# EAGLE design Blueshift V3 (EAGLE 9.5.1)
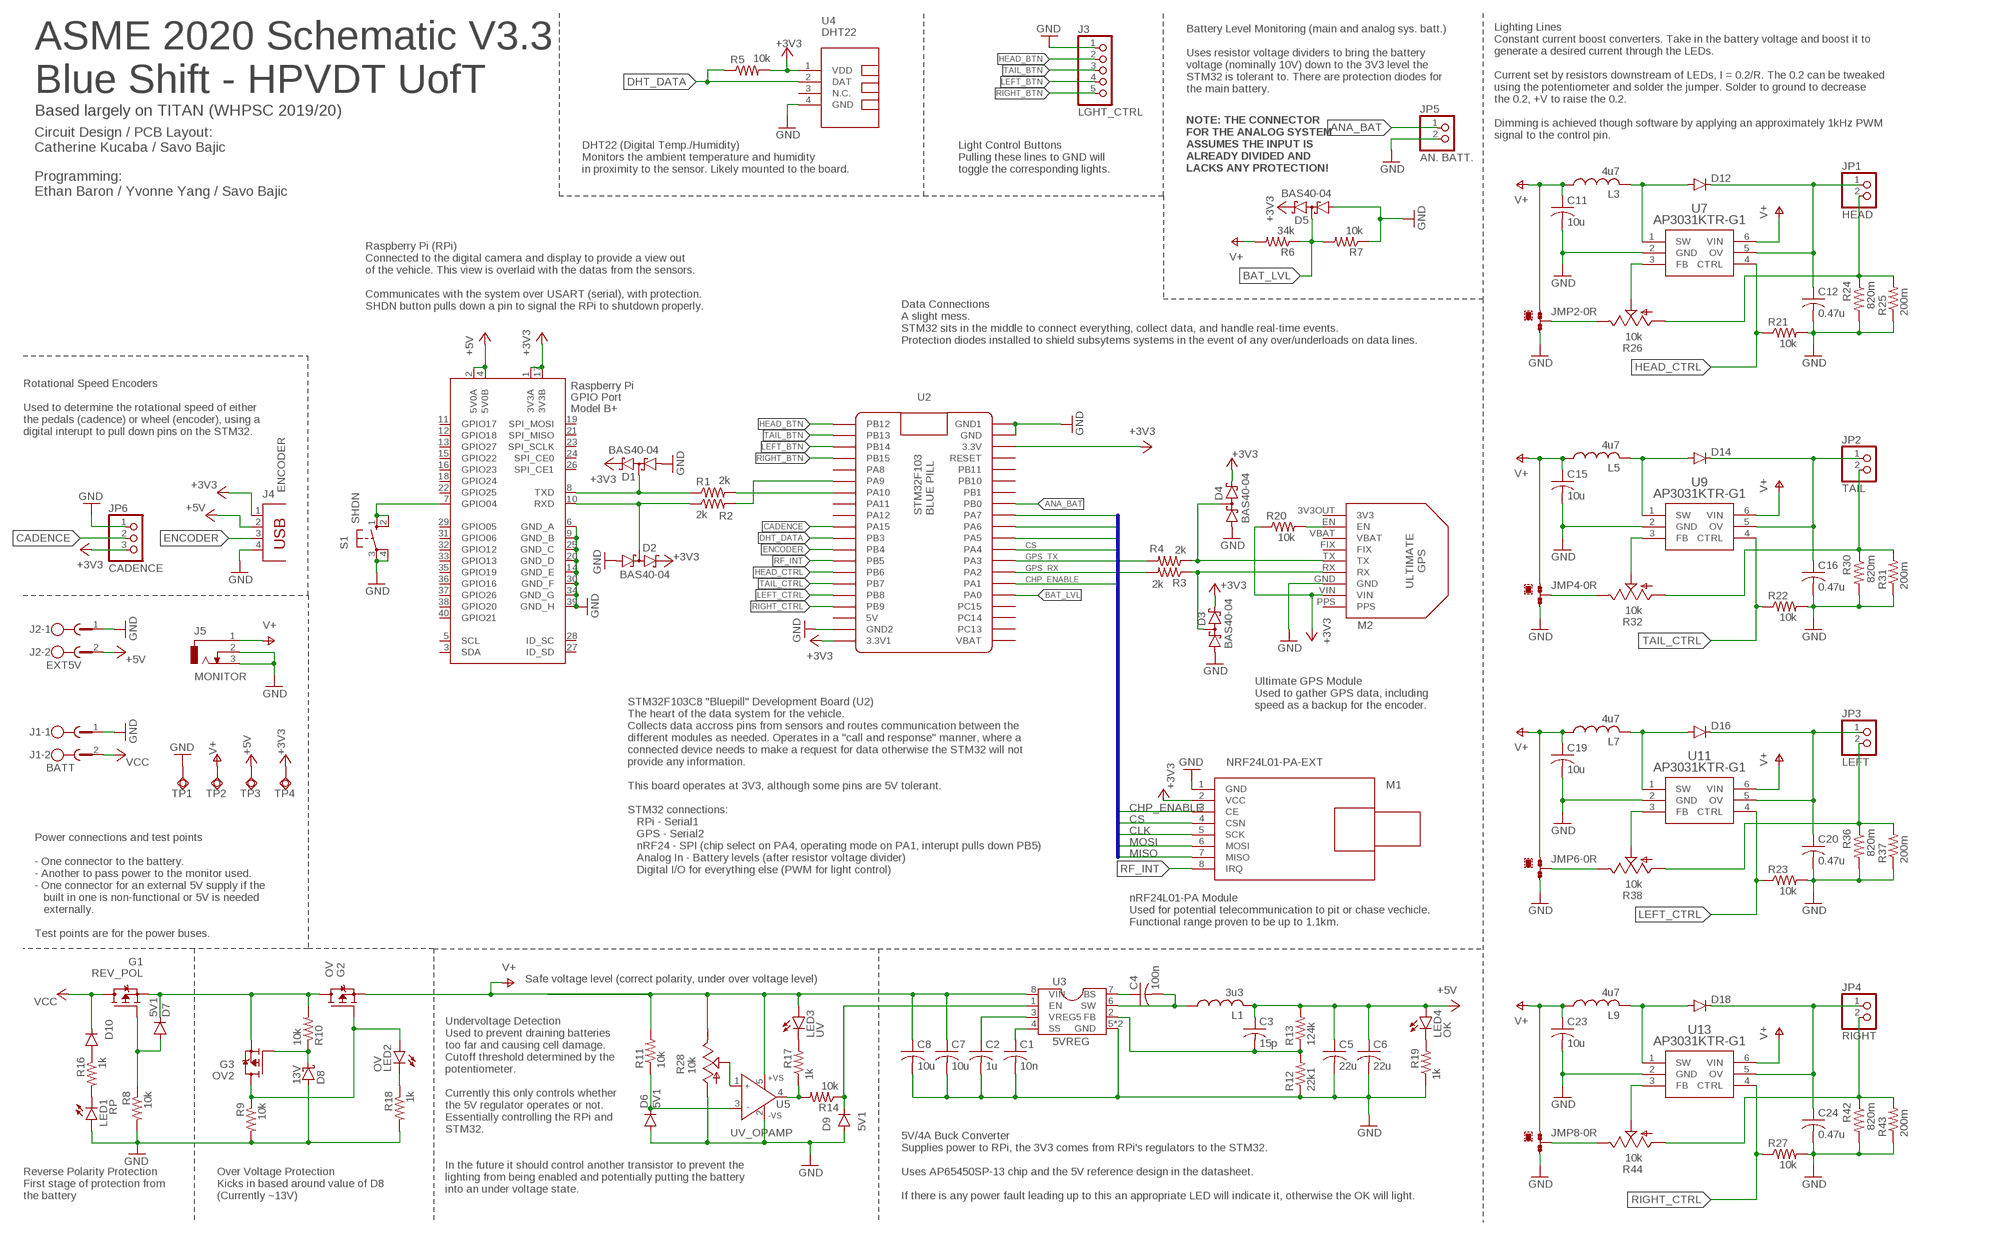
[diagram p0: schematic, sheet 1]

## Parts
C1  10n  C-USC0402  [C0402]
C2  1u  C-USC0402  [C0402]
C3  15p  C-USC0402  [C0402]
C4  100n  C-USC0402  [C0402]
C5  22u  C-USC0805  [C0805]
C6  22u  C-USC0805  [C0805]
C7  10u  C-USC0805  [C0805]
C8  10u  C-USC0805  [C0805]
C11  10u  C-USC1206K  [C1206K]
C12  0.47u  C-USC1206K  [C1206K]
C15  10u  C-USC1206K  [C1206K]
C16  0.47u  C-USC1206K  [C1206K]
C19  10u  C-USC1206K  [C1206K]
C20  0.47u  C-USC1206K  [C1206K]
C23  10u  C-USC1206K  [C1206K]
C24  0.47u  C-USC1206K  [C1206K]
D1  BAS40-04  [SOT23]
D2  BAS40-04  [SOT23]
D3  BAS40-04  [SOT23]
D4  BAS40-04  [SOT23]
D5  BAS40-04  [SOT23]
D6  5V1  DIODE-SOD323-R  [SOD323-R]
D7  5V1  DIODE-SOD323-R  [SOD323-R]
D8  13V  BAS70  [SOT23]
D9  5V1  DIODE-SOD323-R  [SOD323-R]
D10  DIODE-SOD80C  [SOD80C]
D12  DIODE-DO-214AC  [DO-214AC]
D14  DIODE-DO-214AC  [DO-214AC]
D16  DIODE-DO-214AC  [DO-214AC]
D18  DIODE-DO-214AC  [DO-214AC]
G1  REV_POL  SI3493DDV-T1-GE3  [TSOP-6]
G2  OV  SI3493DDV-T1-GE3  [TSOP-6]
G3  OV2  SI3493DDV-T1-GE3  [TSOP-6]
J1  BATT  MST2V  [MSTBV2]
J2  EXT5V  MST2V  [MSTBV2]
J3  LGHT_CTRL  PINHD-1X5  [1X05]
J4  ENCODER  PN87520  [PN87520]
J5  MONITOR  DCJ0303  [DCJ0303]
JMP2  0R-JUMPA  [A0R-JMP]
JMP4  0R-JUMPA  [A0R-JMP]
JMP6  0R-JUMPA  [A0R-JMP]
JMP8  0R-JUMPA  [A0R-JMP]
JP1  HEAD  PINHD-1X2  [1X02]
JP2  TAIL  PINHD-1X2  [1X02]
JP3  LEFT  PINHD-1X2  [1X02]
JP4  RIGHT  PINHD-1X2  [1X02]
JP5  AN. BATT.  PINHD-1X2  [1X02]
JP6  CADENCE  PINHD-1X3  [1X03]
L1  3u3  SDES064T-3R3MS  [SDES064T]
L3  4u7  NR6028NR6028  [INDDFN600X600X280-2N]
L5  4u7  NR6028NR6028  [INDDFN600X600X280-2N]
L7  4u7  NR6028NR6028  [INDDFN600X600X280-2N]
L9  4u7  NR6028NR6028  [INDDFN600X600X280-2N]
LED1  RP  LEDSML0805  [SML0805]
LED2  OV  LEDSML0805  [SML0805]
LED3  UV  LEDSML0805  [SML0805]
LED4  OK  LEDSML0805  [SML0805]
M1  NRF24L01-PA-EXT  WIRELESS-NRF24L01-PA-EXT  [WIRELESS-NRF24L01-PA-EXT]
M2  ULTIMATE-GPS  [ULTIMATE_GPS]
R1  2k  R-US_R0402  [R0402]
R2  2k  R-US_R0402  [R0402]
R3  2k  R-US_R0402  [R0402]
R4  2k  R-US_R0402  [R0402]
R5  10k  R-US_R0402  [R0402]
R6  34k  R-US_R0402  [R0402]
R7  10k  R-US_R0402  [R0402]
R8  10k  R-US_R0402  [R0402]
R9  10k  R-US_R0402  [R0402]
R10  10k  R-US_R0402  [R0402]
R11  10k  R-US_R0402  [R0402]
R12  22k1  R-US_R0402  [R0402]
R13  124k  R-US_R0402  [R0402]
R14  10k  R-US_R0402  [R0402]
R16  1k  R-US_R0402  [R0402]
R17  1k  R-US_R0402  [R0402]
R18  1k  R-US_R0402  [R0402]
R19  1k  R-US_R0402  [R0402]
R20  10k  R-US_R0402  [R0402]
R21  10k  R-US_R0402  [R0402]
R22  10k  R-US_R0402  [R0402]
R23  10k  R-US_R0402  [R0402]
R24  820m  R-US_R0603  [R0603]
R25  200m  R-US_R0805  [R0805]
R26  10k  TRIM_US-RJ9W  [RJ9W]
R27  10k  R-US_R0402  [R0402]
R28  10k  TRIM_US-RJ9W  [RJ9W]
R30  820m  R-US_R0603  [R0603]
R31  200m  R-US_R0805  [R0805]
R32  10k  TRIM_US-RJ9W  [RJ9W]
R36  820m  R-US_R0603  [R0603]
R37  200m  R-US_R0805  [R0805]
R38  10k  TRIM_US-RJ9W  [RJ9W]
R42  820m  R-US_R0603  [R0603]
R43  200m  R-US_R0805  [R0805]
R44  10k  TRIM_US-RJ9W  [RJ9W]
S1  SHDN  10-XX  [B3F-10XX]
TP1  TPSQTP20SQ  [TP20SQ]
TP2  TPSQTP20R  [TP20R]
TP3  TPSQTP20R  [TP20R]
TP4  TPSQTP20R  [TP20R]
U1  RASPI_HAT  [RASPI_BOARD_B+HAT_CF]
U2  BLUEPILL  BLUE_PILL  [BLUE_PILL]
U3  5VREG  AP65450SP-13  [SO-8EP]
U4  DHT22  TEMP-HUM-SENSOR-DHT22  [TEMP-HUM-SENSOR-DHT22]
U5  UV_OPAMP  TA75S558F,LF  [SOT-753]
U7  AP3031KTR-G1  [SOT23-6]
U9  AP3031KTR-G1  [SOT23-6]
U11  AP3031KTR-G1  [SOT23-6]
U13  AP3031KTR-G1  [SOT23-6]

## Nets
5V_FB: C3.2 R12.2 R13.1 U3.2(FB)
+3V3: D1.2(C2) D2.2(C2) D3.2(C2) D4.2(C2) D5.2(C2) J4.1 JP6.3 M1.2(VCC) M2.VIN R5.2 R20.1 TP4.TP U1.1(3V3A) U1.17(3V3B) U2.P$20(3.3V1) U2.P$23(3.3V) U4.1(VDD)
+5V: C3.1 C5.1 C6.1 J2.2 J4.2 L1.2 LED4.A R13.2 TP3.TP U1.2(5V0A) U1.4(5V0B)
ANA_BAT: JP5.1 U2.P$28(PB0)
BAT_LVL: D5.3(C1A2) R6.1 R7.2 U2.P$36(PA0)
CADENCE: JP6.2 U2.P$10(PA15)
CHP_ENABLE: M1.3(CE) U2.P$35(PA1)
CLK: M1.5(SCK) U2.P$31(PA5)
CS: M1.4(CSN) U2.P$32(PA4)
DHT_DATA: R5.1 U2.P$11(PB3) U4.2(DAT)
ENCODER: J4.3 U2.P$12(PB4)
GND: C1.2 C2.2 C5.2 C6.2 C7.2 C8.2 C11.2 C12.2 C15.2 C16.2 C19.2 C20.2 C23.2 C24.2 D1.1(A1) D2.1(A1) D3.1(A1) D4.1(A1) D5.1(A1) D6.A D8.1(A) D9.A J1.1 J2.1 J3.1 J4.4 J5.2 J5.3 JMP2.3 JMP4.3 JMP6.3 JMP8.3 JP5.2 JP6.1 LED1.A M1.1(GND) M2.GND R7.1 R8.2 R9.2 R12.1 R18.2 R19.1 R21.2 R22.2 R23.2 R24.2 R25.1 R27.2 R28.A R30.2 R31.1 R36.2 R37.1 R42.2 R43.1 S1.3(P) S1.4(P1) TP1.TP U1.6(GND_A) U1.9(GND_B) U1.14(GND_E) U1.20(GND_D) U1.25(GND_C) U1.30(GND_F) U1.34(GND_G) U1.39(GND_H) U2.P$19(GND2) U2.P$21(GND1) U2.P$22(GND) U3.5(GND) U3.TP(GND) U4.4(GND) U5.2(-VS) U7.2(GND) U9.2(GND) U11.2(GND) U13.2(GND)
GPS_RX: R3.2 U2.P$34(PA2)
GPS_TX: R4.2 U2.P$33(PA3)
HEAD_BTN: J3.2 U2.P$1(PB12)
HEAD_CTRL: R21.1 U2.P$14(PB6) U7.4(CTRL)
LEFT_BTN: J3.4 U2.P$3(PB14)
LEFT_CTRL: R23.1 U2.P$16(PB8) U11.4(CTRL)
MISO: M1.7(MISO) U2.P$30(PA6)
MOSI: M1.6(MOSI) U2.P$29(PA7)
N$1: R1.2 U2.P$7(PA10)
N$2: R2.2 U2.P$6(PA9)
N$3: D1.3(C1A2) R1.1 U1.8(TXD)
N$4: D2.3(C1A2) R2.1 U1.10(RXD)
N$5: D3.3(C1A2) M2.RX R3.1
N$6: S1.1(S) S1.2(S1) U1.7(GPIO04)
N$7: D8.3(C) G3.3(G) R10.1
N$8: D7.A G1.3(G) R8.1
N$9: D4.3(C1A2) M2.TX R4.1
N$10: G2.3(G) G3.1(D) G3.2(D) G3.5(D) G3.6(D) LED2.A R9.1
N$11: LED3.C R17.2
N$12: C1.1 U3.4(SS)
N$13: D6.C R11.1 U5.3(IN-)
N$14: C4.2 L1.1 U3.6(SW)
N$15: C2.1 U3.3(VREG5)
N$16: C4.1 U3.7(BS)
N$17: R14.2 R17.1 U5.4(OUT)
N$18: D9.C R14.1 U3.1(EN)
N$19: R28.S U5.1(IN+)
N$20: LED1.C R16.2
N$21: D10.A R16.1
N$22: M2.EN R20.2
N$23: LED2.C R18.1
N$24: LED4.C R19.2
N$25: D7.C G1.4(S) G2.1(D) G2.2(D) G2.5(D) G2.6(D) G3.4(S) R10.2
N$31: D12.A L3.2 U7.1(SW)
N$32: JMP2.2 R26.E
N$33: R26.S U7.3(FB)
N$34: C12.1 D12.C JP1.1 U7.5(OV)
N$35: JP1.2 R24.1 R25.2 R26.A
N$41: D14.A L5.2 U9.1(SW)
N$42: JMP4.2 R32.E
N$43: R32.S U9.3(FB)
N$44: C16.1 D14.C JP2.1 U9.5(OV)
N$45: JP2.2 R30.1 R31.2 R32.A
N$51: D16.A L7.2 U11.1(SW)
N$52: JMP6.2 R38.E
N$53: R38.S U11.3(FB)
N$54: C20.1 D16.C JP3.1 U11.5(OV)
N$55: JP3.2 R36.1 R37.2 R38.A
N$61: D18.A L9.2 U13.1(SW)
N$62: JMP8.2 R44.E
N$63: R44.S U13.3(FB)
N$64: C24.1 D18.C JP4.1 U13.5(OV)
N$65: JP4.2 R42.1 R43.2 R44.A
RF_INT: M1.8(IRQ) U2.P$13(PB5)
RIGHT_BTN: J3.5 U2.P$4(PB15)
RIGHT_CTRL: R27.1 U2.P$17(PB9) U13.4(CTRL)
TAIL_BTN: J3.3 U2.P$2(PB13)
TAIL_CTRL: R22.1 U2.P$15(PB7) U9.4(CTRL)
V+: C7.1 C8.1 C11.1 C15.1 C19.1 C23.1 G2.4(S) J5.1 JMP2.1 JMP4.1 JMP6.1 JMP8.1 L3.1 L5.1 L7.1 L9.1 LED3.A R6.2 R11.2 R28.E TP2.TP U3.8(VIN) U5.5(+VS) U7.6(VIN) U9.6(VIN) U11.6(VIN) U13.6(VIN)
VCC: D10.C G1.1(D) G1.2(D) G1.5(D) G1.6(D) J1.2
Unconnected: M2.3V3OUT(3V3) M2.FIX M2.PPS M2.VBAT U1.3(SDA) U1.5(SCL) U1.11(GPIO17) U1.12(GPIO18) U1.13(GPIO27) U1.15(GPIO22) U1.16(GPIO23) U1.18(GPIO24) U1.19(SPI_MOSI) U1.21(SPI_MISO) U1.22(GPIO25) U1.23(SPI_SCLK) U1.24(SPI_CE0) U1.26(SPI_CE1) U1.27(ID_SD) U1.28(ID_SC) U1.29(GPIO05) U1.31(GPIO06) U1.32(GPIO12) U1.33(GPIO13) U1.35(GPIO19) U1.36(GPIO16) U1.37(GPIO26) U1.38(GPIO20) U1.40(GPIO21) U2.P$5(PA8) U2.P$8(PA11) U2.P$9(PA12) U2.P$18(5V) U2.P$24(RESET) U2.P$25(PB11) U2.P$26(PB10) U2.P$27(PB1) U2.P$37(PC15) U2.P$38(PC14) U2.P$39(PC13) U2.P$40(VBAT) U4.3(N.C.)

## Buses
SPI:CHP_ENABLE,CLK,CS,MISO,MOSI,RF_INT

## Notes on the sheet
- Battery Level Monitoring (main and analog sys. batt.)
  
  Uses resistor voltage dividers to bring the battery 
  voltage (nominally 10V) down to the 3V3 level the
  STM32 is tolerant to. There are protection diodes for
  the main battery.
- ASME 2020 Schematic V3.3
  Blue Shift - HPVDT UofT
- Based largely on TITAN (WHPSC 2019/20)
- NOTE: THE CONNECTOR
  FOR THE ANALOG SYSTEM
  ASSUMES THE INPUT IS
  ALREADY DIVIDED AND
  LACKS ANY PROTECTION!
- Lighting Lines
  Constant current boost converters. Take in the battery voltage and boost it to 
  generate a desired current through the LEDs.
  
  Current set by resistors downstream of LEDs, I = 0.2/R. The 0.2 can be tweaked
  using the potentiometer and solder the jumper. Solder to ground to decrease 
  the 0.2, +V to raise the 0.2.
  
  Dimming is achieved though software by applying an approximately 1kHz PWM
  signal to the control pin.
- DHT22 (Digital Temp./Humidity)
  Monitors the ambient temperature and humidity
  in proximity to the sensor. Likely mounted to the board.
- Light Control Buttons
  Pulling these lines to GND will
  toggle the corresponding lights.
- Circuit Design / PCB Layout:
  Catherine Kucaba / Savo Bajic
  
  Programming:
  Ethan Baron / Yvonne Yang / Savo Bajic
- Raspberry Pi (RPi)
  Connected to the digital camera and display to provide a view out
  of the vehicle. This view is overlaid with the datas from the sensors.
  
  Communicates with the system over USART (serial), with protection.
  SHDN button pulls down a pin to signal the RPi to shutdown properly.
- Data Connections
  A slight mess.
  STM32 sits in the middle to connect everything, collect data, and handle real-time events.
  Protection diodes installed to shield subsytems systems in the event of any over/underloads on data lines.
- Rotational Speed Encoders
  
  Used to determine the rotational speed of either
  the pedals (cadence) or wheel (encoder), using a
  digital interupt to pull down pins on the STM32.
- STM32F103C8 "Bluepill" Development Board (U2)
  The heart of the data system for the vehicle. 
  Collects data accross pins from sensors and routes communication between the 
  different modules as needed. Operates in a "call and response" manner, where a 
  connected device needs to make a request for data otherwise the STM32 will not
  provide any information.
  
  This board operates at 3V3, although some pins are 5V tolerant.
  
  STM32 connections:
     RPi - Serial1
     GPS - Serial2
     nRF24 - SPI (chip select on PA4, operating mode on PA1, interupt pulls down PB5)
     Analog In - Battery levels (after resistor voltage divider)
     Digital I/O for everything else (PWM for light control)
- Ultimate GPS Module
  Used to gather GPS data, including
  speed as a backup for the encoder.
- nRF24L01-PA Module
  Used for potential telecommunication to pit or chase vechicle.
  Functional range proven to be up to 1.1km.
- Power connections and test points
  
  - One connector to the battery.
  - Another to pass power to the monitor used.
  - One connector for an external 5V supply if the
     built in one is non-functional or 5V is needed
     externally. 
  
  Test points are for the power buses.
- Safe voltage level (correct polarity, under over voltage level)
- Undervoltage Detection
  Used to prevent draining batteries
  too far and causing cell damage.
  Cutoff threshold determined by the
  potentiometer.
  
  Currently this only controls whether
  the 5V regulator operates or not.
  Essentially controlling the RPi and
  STM32.
  
  
  In the future it should control another transistor to prevent the
  lighting from being enabled and potentially putting the battery
  into an under voltage state.
- Reverse Polarity Protection
  First stage of protection from
  the battery
- Over Voltage Protection
  Kicks in based around value of D8
  (Currently ~13V)
- 5V/4A Buck Converter
  Supplies power to RPi, the 3V3 comes from RPi's regulators to the STM32.
  
  Uses AP65450SP-13 chip and the 5V reference design in the datasheet.
  
  If there is any power fault leading up to this an appropriate LED will indicate it, otherwise the OK will light.

## Library data of the parts
C1-C8 C11 C12 C15 C16 C19 C20 C23 C24 = rcl:C-US: CAPACITOR, American symbol; SPICEPREFIX: C
D1-D5 = diode:BAS40-04: Silicon Schottky Diodes General-purpose diode for high-speed switching
D6 D7 D9 D10 D12 D14 D16 D18 = diode:DIODE-: DIODE
D8 = diode:BAS70: Silicon Schottky Diodes General-purpose diode for high-speed switching
G1-G3 = ASME2020_parts:SI3493DDV-T1-GE3: 20V P-CH MOSFET
J1 J2 = con-phoenix-508:MST2V: PHOENIX; OC_FARNELL: unknown; OC_NEWARK: unknown
J3 = pinhead:PINHD-1X5: PIN HEADER
J4 = con-berg:PN87520: BERG USB connector; OC_FARNELL: unknown; OC_NEWARK: unknown
J5 = con-jack:DCJ0303: DC POWER JACK Source: DCJ0303.pdf; OC_FARNELL: unknown; OC_NEWARK: unknown
JMP2 JMP4 JMP6 JMP8 = jump-0r-smd:0R-JUMP: SMD 0R 0805 Jumper
JP1-JP5 = pinhead:PINHD-1X2: PIN HEADER
JP6 = pinhead:PINHD-1X3: PIN HEADER
L1 = ASME2020_parts:SDES064T-3R3MS
L3 L5 L7 L9 = Lighting IC:NR6028
LED1-LED4 = led:LED: LED OSRAM: - CHIPLED LG R971, LG N971, LY N971, LG Q971, LY Q971, LO R971, LY R971 LH N974, LH R974 LS Q976, LO Q976, LY Q976 LO Q996 - Hyper CHIPLED LW Q18S LB Q993, LB Q99A, LB R99A - SideLED LS A670, LO A670, LY A670, LG A670, LP A670 LB A673, LV A673, LT A673, LW A673 LH A674 LY A675 LS A676, LA A676, LO A676, LY A676, LW A676 LS A679, LY A679, LG A679 - Hyper Micro SIDELED® LS Y876, LA Y876, LO Y876, LY Y876 LT Y87S - SmartLED LW L88C, LW L88S LB L89C, LB L89S, LG L890 LS L89K, LO L89K, LY L89K LS L896, LA L896, LO L896, LY L896 - TOPLED LS T670, LO T670, LY T670, LG T670, LP T670 LSG T670, LSP T670, LSY T670, LOP T670, LYG T670 LG T671, LOG T671, LSG T671 LB T673, LV T673, LT T673, LW T673 LH T674 LS T676, LA T676, LO T676, LY T676, LB T676, LH T676, LSB T676, LW T676 LB T67C, LV T67C, LT T67C, LS T67K, LO T67K, LY T67K, LW E67C LS E67B, LA E67B, LO E67B, LY E67B, LB E67C, LV E67C, LT E67C LW T67C LS T679, LY T679, LG T679 LS T770, LO T770, LY T770, LG T770, LP T770 LB T773, LV T773, LT T773, LW T773 LH T774 LS E675, LA E675, LY E675, LS T675 LS T776, LA T776, LO T776, LY T776, LB T776 LHGB T686 LT T68C, LB T68C - Hyper Mini TOPLED® LB M676 - Mini TOPLED Santana® LG M470 LS M47K, LO M47K, LY M47K Source: http://www.osram.convergy.de LUXEON: - LUMILED® LXK2-PW12-R00, LXK2-PW12-S00, LXK2-PW14-U00, LXK2-PW14-V00 LXK2-PM12-R00, LXK2-PM12-S00, LXK2-PM14-U00 LXK2-PE12-Q00, LXK2-PE12-R00, LXK2-PE12-S00, LXK2-PE14-T00, LXK2-PE14-U00 LXK2-PB12-K00, LXK2-PB12-L00, LXK2-PB12-M00, LXK2-PB14-N00, LXK2-PB14-P00, LXK2-PB14-Q00 LXK2-PR12-L00, LXK2-PR12-M00, LXK2-PR14-Q00, LXK2-PR14-R00 LXK2-PD12-Q00, LXK2-PD12-R00, LXK2-PD12-S00 LXK2-PH12-R00, LXK2-PH12-S00 LXK2-PL12-P00, LXK2-PL12-Q00, LXK2-PL12-R00 Source: www.luxeon.com KINGBRIGHT: KA-3528ASYC Source: www.kingbright.com
M1 = diy-modules:WIRELESS-NRF24L01-PA-EXT: 2.4 GHz Wireless Module based on NRF24L01 chip with preamplifier and external antenna Click here to find device on ebay.com <http://www.ebay.com/sch/nrf24l01+pa+lna+sma>
M2 = diy-modules:ULTIMATE-GPS
R1-R14 R16-R25 R27 R30 R31 R36 R37 R42 R43 = rcl:R-US_: RESISTOR, American symbol; SPICEPREFIX: R
R26 R28 R32 R38 R44 = pot:TRIM_US-: POTENTIOMETER
S1 = switch-omron:10-XX: OMRON SWITCH; MPN: B3F-1000; OC_FARNELL: 176432; OC_NEWARK: 36M3542
TP1-TP4 = testpad:TPSQ: Test pad
U1 = raspberrypi_bastelstube_v13:RASPI_HAT
U2 = BluePill:BLUE_PILL
U3 = ASME2020_parts:AP65450SP-13: AP65450 4A, 18V, 650kHz ADAPTIVE COT STEP-DOWN CONVERTER
U4 = diy-modules:TEMP-HUM-SENSOR-DHT22: DHT22 - digital humidity & temperature sensor Also known as: AM2302 AM2302 datasheet available here: http://akizukidenshi.com/download/ds/aosong/AM2302.pdf Click here to find device on ebay.com <http://www.ebay.com/sch/dht22+digital+sensor>
U5 = ASME2020_parts:TA75S558F,LF
U7 U9 U11 U13 = Lighting IC:AP3031KTR-G1: AP3031 step-up LED driver chip for LEDs up to 1.4A; MANUFACTURER_PART_NUMBER: AP3031KTRG1; VENDOR: Diodes Inc

## Board
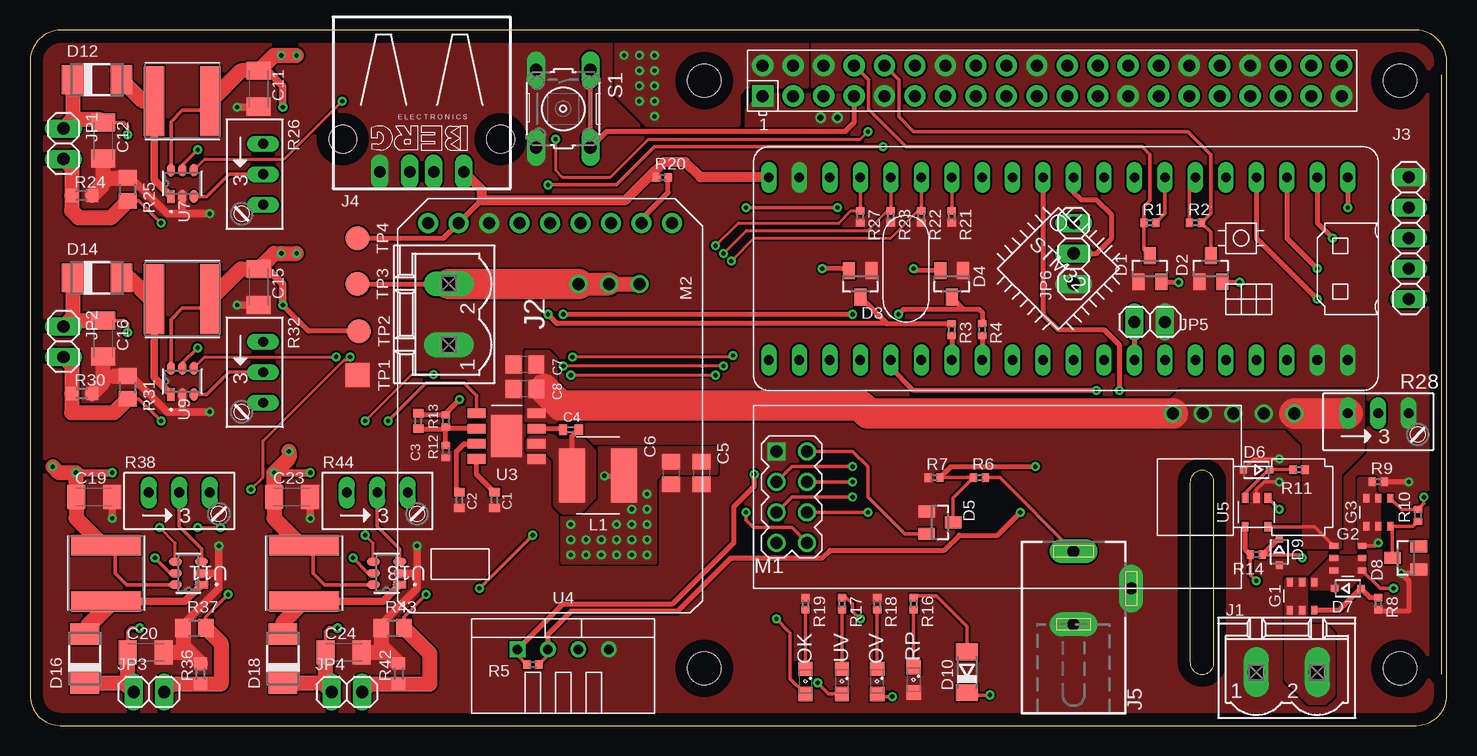
[diagram p1: board, top side]
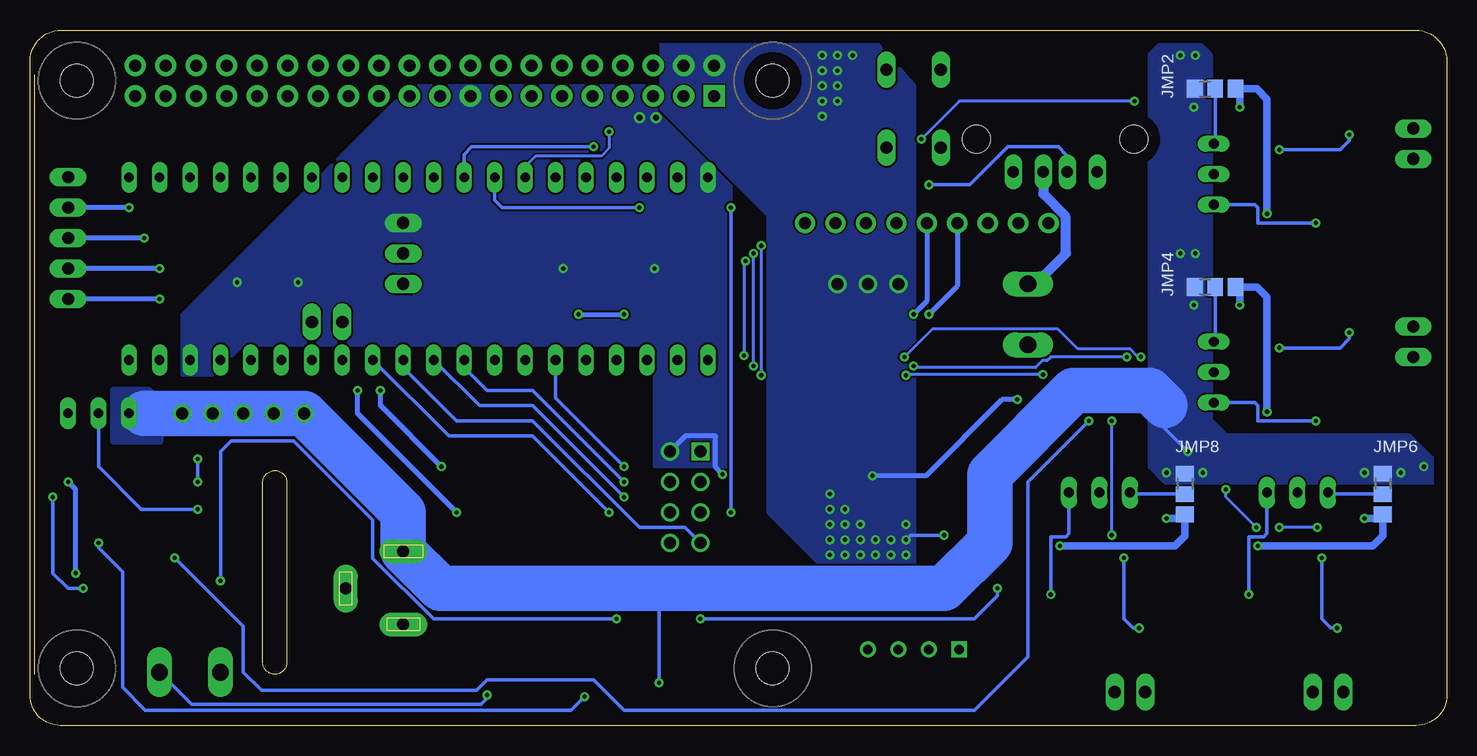
[diagram p2: board, bottom side, seen from below]

Size 118.11 x 58 mm. Coordinates in mm from the lower left corner, seen from the top.
Outline: 2.54,0 115.57,0 arc90 118.11,2.54 118.11,55.24 arc90 115.57,58 2.54,58 arc90 0,55.24 0,2.54 arc90 2.54,0
Copper layers (1*16): Top 0.035mm / dielectric 1.5mm / Bottom 0.035mm
Design rules "default": minimum track width 6mil, minimum drill 0.35mm, track to track 6mil, track to pad 6mil, pad to pad 6mil, via to via 6mil, smd to smd 6mil, copper to edge 40mil, drill to drill 6mil, minimum pad ring 10mil, minimum via ring 8mil, stop-mask expansion 4mil, vias tented up to drill 0mil, thermal gap 10mil

### Footprints (pad centres in the part's own frame; a part is rotated, then mirrored left to right if it is on the bottom)
C0402 = smd 0.7 x 0.9: 1 -0.65,0; 2 0.65,0
C0805 = smd 1.3 x 1.5: 1 -0.95,0; 2 0.95,0
C1206K = smd 1.5 x 2: 1 -1.5,0; 2 1.5,0
SOT23 = smd 1 x 1.4: 1 -0.95,-1.1; 2 0.95,-1.1; 3 0,1.1
SOD323-R = smd 0.6 x 0.6: A 1.1,0; C -1.1,0
SOD80C = smd 1.4 x 1.8: A 1.7,0; C -1.7,0
DO-214AC = smd 1.8 x 2.4: A 2.025,0; C -2.025,0
TSOP-6 = smd 0.508 x 0.711: 1 -1.016,-1.168; 2 0,-1.168; 3 1.016,-1.168; 4 1.016,1.168; 5 0,1.168; 6 -1.016,1.168
MSTBV2 = drill 1.397 long: 1 -2.54,0; 2 2.54,0
1X05 = drill 1.016 long: 1 -5.08,0; 2 -2.54,0; 3 0,0; 4 2.54,0; 5 5.08,0
PN87520 = drill 0.95 long: 1 -3.5,2.71; 2 -1,2.71; 3 1,2.71; 4 3.5,2.71 | hole 2.3: -6.57,0; 6.57,0
DCJ0303 = drill 1 pad 2 long: 1 0,3.1; 2 4.8,0; 3 0,-3
A0R-JMP = smd 1.5 x 1.3: 1 0,1.7; 2 0,0; 3 0,-1.7
1X02 = drill 1.016 long: 1 -1.27,0; 2 1.27,0
1X03 = drill 1.016 long: 1 -2.54,0; 2 0,0; 3 2.54,0
SDES064T = smd 2.15 x 4.5: 1 -2.175,0; 2 2.175,0
INDDFN600X600X280-2N = smd 1.712 x 5.812: 1 -2.35,0; 2 2.35,0
SML0805 = smd 1.2 x 1.2: A 1.05,0; C -1.05,0
WIRELESS-NRF24L01-PA-EXT = drill 1 square: 1 -18.415,3.81 | drill 1: 2 -15.875,3.81; 3 -18.415,1.27; 4 -15.875,1.27; 5 -18.415,-1.27; 6 -15.875,-1.27; 7 -18.415,-3.81; 8 -15.875,-3.81
ULTIMATE_GPS = drill 1 pad 1.676: 3V3OUT 0,10.16; EN 0,7.62; FIX 0,2.54; GND 0,-5.08; PPS 0,-10.16; RX 0,-2.54; TX 0,0; VBAT 0,5.08; VIN 0,-7.62
R0402 = smd 0.6 x 0.7: 1 -0.5,0; 2 0.5,0
R0603 = smd 1 x 1.1: 1 -0.85,0; 2 0.85,0
R0805 = smd 1.3 x 1.5: 1 -0.95,0; 2 0.95,0
RJ9W = drill 0.813 long: A 2.54,0.635; E -2.54,0.635; S 0,0.635
B3F-10XX = drill 1.016 long: 1 -3.251,2.261; 2 3.251,2.261; 3 -3.251,-2.261; 4 3.251,-2.261
TP20SQ = smd 2 x 2: TP 0,0
TP20R = smd 2 x 2: TP 0,0
RASPI_BOARD_B+HAT_CF = drill 1 pad 1.778 square: 1 8.37,51.23 | drill 1 pad 1.778: 2 8.37,53.77; 3 10.91,51.23; 4 10.91,53.77; 5 13.45,51.23; 6 13.45,53.77; 7 15.99,51.23; 8 15.99,53.77; 9 18.53,51.23; 10 18.53,53.77; 11 21.07,51.23; 12 21.07,53.77; 13 23.61,51.23; 14 23.61,53.77; 15 26.15,51.23; 16 26.15,53.77; 17 28.69,51.23; 18 28.69,53.77; 19 31.23,51.23; 20 31.23,53.77; 21 33.77,51.23; 22 33.77,53.77; 23 36.31,51.23; 24 36.31,53.77; 25 38.85,51.23; 26 38.85,53.77; 27 41.39,51.23; 28 41.39,53.77; 29 43.93,51.23; 30 43.93,53.77; 31 46.47,51.23; 32 46.47,53.77; 33 49.01,51.23; 34 49.01,53.77; 35 51.55,51.23; 36 51.55,53.77; 37 54.09,51.23; 38 54.09,53.77; 39 56.63,51.23; 40 56.63,53.77 | hole 2.75: 3.5,3.5; 3.5,52.5; 61.5,3.5; 61.5,52.5
BLUE_PILL = drill 0.8 long: P$1 -7.62,15.24; P$2 -7.62,12.7; P$3 -7.62,10.16; P$4 -7.62,7.62; P$5 -7.62,5.08; P$6 -7.62,2.54; P$7 -7.62,0; P$8 -7.62,-2.54; P$9 -7.62,-5.08; P$10 -7.62,-7.62; P$11 -7.62,-10.16; P$12 -7.62,-12.7; P$13 -7.62,-15.24; P$14 -7.62,-17.78; P$15 -7.62,-20.32; P$16 -7.62,-22.86; P$17 -7.62,-25.4; P$18 -7.62,-27.94; P$19 -7.62,-30.48; P$20 -7.62,-33.02; P$21 7.62,15.24; P$22 7.62,12.7; P$23 7.62,10.16; P$24 7.62,7.62; P$25 7.62,5.08; P$26 7.62,2.54; P$27 7.62,0; P$28 7.62,-2.54; P$29 7.62,-5.08; P$30 7.62,-7.62; P$31 7.62,-10.16; P$32 7.62,-12.7; P$33 7.62,-15.24; P$34 7.62,-17.78; P$35 7.62,-20.32; P$36 7.62,-22.86; P$37 7.62,-25.4; P$38 7.62,-27.94; P$39 7.62,-30.48; P$40 7.62,-33.02
SO-8EP = smd 0.802 x 1.505: 1 -1.905,-2.498; 2 -0.635,-2.498; 3 0.635,-2.498; 4 1.905,-2.498; 5 1.905,2.498; 6 0.635,2.498; 7 -0.635,2.498; 8 -1.905,2.498 | smd 3.502 x 2.613: TP 0,0
TEMP-HUM-SENSOR-DHT22 = drill 0.8 square: 1 -3.81,0 | drill 0.8: 2 -1.27,0; 3 1.27,0; 4 3.81,0
SOT-753 = smd 0.8 x 0.55: 1 -1.2,0.95; 2 -1.2,0; 3 -1.2,-0.95; 4 1.2,-0.95; 5 1.2,0.95
SOT23-6 = smd 1.06 x 0.65: 1 -1.1,0.95; 2 -1.1,0; 3 -1.1,-0.95; 4 1.1,-0.95; 5 1.1,0; 6 1.1,0.95

### Placement (x,y rotation side)
C1  38.72,18.8 270 top
C2  35.8,18.8 270 top
C3  32.37,25.4 270 top
C4  45.08,24.67 0 top
C5  55.98,21.06 270 top
C6  53.44,21.06 270 top
C7  41.26,30.1 180 top
C8  41.26,28.07 180 top
C11  19.05,53.09 270 top
C12  6.1,48.77 270 top
C15  19.05,36.58 270 top
C16  6.1,32.26 270 top
C19  5.33,19.05 0 top
C20  9.65,6.1 0 top
C23  21.84,19.05 0 top
C24  26.16,6.1 0 top
D1  93.34,38.1 0 top
D2  98.42,38.1 0 top
D3  69.22,36.83 180 top
D4  76.84,36.83 180 top
D5  75.85,16.93 270 top
D6  102.23,21.32 180 top
D7  109.86,11.43 0 top
D8  114.68,13.97 90 top
D9  104.14,14.48 270 top
D10  78.1,4.45 90 top
D12  5.59,53.85 0 top
D14  5.59,37.34 0 top
D16  4.57,5.59 90 top
D18  21.08,5.59 90 top
G1  106.05,10.79 0 top
G2  109.86,13.97 90 top
G3  112.39,17.78 0 top
J1  104.78,4.45 0 top
J2  34.92,34.29 90 top
J3  114.94,40.64 270 top
J4  32.65,48.89 180 top
J5  87,11.43 0 top
JMP2  19.3,53.09 90 bottom
JMP4  19.3,36.58 90 bottom
JMP6  5.33,19.3 0 bottom
JMP8  21.84,19.3 0 bottom
JP1  2.79,48.51 270 top
JP2  2.79,32 270 top
JP3  9.91,2.79 0 top
JP4  26.42,2.79 0 top
JP5  93.34,33.66 0 top
JP6  87,39.37 90 top
L1  47.36,20.86 0 top
L3  12.7,52.07 180 top
L5  12.7,35.56 180 top
L7  6.35,12.7 270 top
L9  22.86,12.7 270 top
LED1  73.66,3.81 270 top
LED2  70.61,3.68 270 top
LED3  67.69,3.68 270 top
LED4  64.64,3.68 270 top
M1  80.64,19.05 0 top
M2  43.36,41.91 270 top
R1  93.34,41.91 0 top
R2  97.16,41.91 180 top
R3  76.84,33.02 270 top
R4  79.38,33.02 270 top
R5  41.91,5.08 180 top
R6  79.16,20.67 0 top
R7  75.34,20.67 0 top
R8  112.39,10.16 270 top
R9  112.39,20.32 0 top
R10  115.7,17.53 90 top
R11  105.79,21.34 0 top
R12  34.66,22.86 90 top
R13  34.66,25.4 90 top
R14  102.23,14.24 180 top
R16  73.66,10.16 270 top
R17  67.69,10.16 270 top
R18  70.61,10.16 90 top
R19  64.64,10.16 270 top
R20  52.7,45.72 0 top
R21  76.84,42.42 270 top
R22  74.3,42.42 270 top
R23  71.75,42.42 270 top
R24  4.32,44.2 0 top
R25  8.13,44.7 270 top
R26  18.8,45.97 270 top
R27  69.22,42.42 270 top
R28  112.39,25.4 0 top
R30  4.32,27.69 0 top
R31  8.13,28.19 270 top
R32  18.8,29.46 270 top
R36  14.22,4.32 90 top
R37  13.72,8.13 0 top
R38  12.45,18.8 0 top
R42  30.73,4.32 90 top
R43  30.23,8.13 0 top
R44  28.96,18.8 0 top
S1  44.45,51.44 270 top
TP1  27.3,29.21 270 top
TP2  27.43,32.89 270 top
TP3  27.3,36.83 270 top
TP4  27.3,40.64 270 top
U1  52.7,1.27 0 top
U2  94.61,38.1 270 top
U3  39.73,24.13 270 top
U4  44.45,6.35 0 top
U5  102.23,17.78 270 top
U7  12.7,45.21 90 top
U9  12.7,28.7 90 top
U11  13.21,12.7 180 top
U13  29.72,12.7 180 top

### Tracks (layer width: path | path; a pad name or v marks a point on that pad's centre or on a via)
5V_FB
  Top 0.406: R12.2 R13.1 | U3.2 34.79,24.77 R13.1 | C3.2 34.5,24.75 R13.1
+3V3  (via drill 0.35, 0.5)
  Top 0.305: D5.2 72.92,15.97 69.85,19.05 69.85,21.59 68.58,22.86 M1.2 | R5.2 40.64,5.85 U4.1
  Top 0.406: 37.64,43.81 M2.VIN 34.47,40.64 TP4.TP | D3.2 68.09,38.1 v66.04,38.1 | D4.2 73.83,37.93 v73.66,38.1 | D1.2 95.72,37 v95.76,36.96 | D2.2 100.8,37 v100.84,36.96 | U4.1 44.45,10.16 53.57,10.16 58.65,15.24 58.65,18.23 60.37,19.95 v60.37,20.95
  Top 0.813: J4.1 37.64,44.69 37.64,43.81 49.67,43.81 51.57,45.72 | R20.1 51.57,45.72 | U2.P$20 55.88,45.72 54.61,46.99 52.84,46.99 51.57,45.72
  Bottom 0.406: v60.37,20.95 60.96,21.54 60.96,24.13 63.5,24.13 M1.2
  other vias: 65.91,50.67 67.31,50.67
  pour Bottom (rank 2, no thermals): 59.69,21.59 59.69,45.72 64.77,50.8 64.77,53.34 86.36,53.34 105.41,34.29 105.41,29.21 102.87,29.21 100.33,31.75 66.04,31.75 66.04,21.59
  pour Top (no thermals): 59.69,50.16 59.69,51.44 60.96,52.7 68.58,52.7 68.58,50.16 67.94,49.53 59.69,49.53
+5V  (via drill 0.35, 1)
  Top 0.305: LED4.A 63.37,3.9 63.37,7.75 v62.23,8.89 | v37.47,11.43 v41.91,15.88
  Top 0.406: C3.1 32.52,25.9 R13.2 34.66,26.02 v35.81,27.18 | v47.88,20.83 49.5,20.83 L1.2 | TP3.TP J2.2
  Top 1.27: v48.26,36.83 v50.8,36.83
  Top 1.905: v45.72,36.83 v48.26,36.83
  Top 2.54: J2.2 v45.72,36.83
  Bottom 0.305: v62.23,8.89 39.37,8.89 37.47,10.79 v37.47,11.43 | v41.91,15.88 44.7,15.88 v45.08,15.49
  Bottom 0.406: v35.81,27.18 37.08,27.18 43.43,20.83 v47.88,20.83
  Bottom 0.813: J4.2 33.65,44.34 31.8,42.49 31.8,39.42 31.75,39.37 34.29,36.83 J2.2
  other vias: 49.53,55.88 50.8,55.88 52.07,55.88 50.8,54.61 52.07,54.61 50.8,53.34 52.07,53.34 50.8,52.07 52.07,52.07 52.07,50.8 51.44,19.3 51.44,18.03 50.17,18.03 50.17,16.76 48.89,16.76 51.44,16.76 51.44,15.49 50.17,15.49 48.89,15.49 47.62,15.49 46.36,15.49 45.08,16.76 45.08,14.22 46.36,14.22 47.62,14.22 48.89,14.22 50.17,14.22 51.44,14.22
  pour Top (rank 2, no thermals): 44.45,13.59 44.45,23.11 57.15,23.11 57.15,21.08 52.58,21.08 52.07,20.57 52.07,13.59
  pour Bottom (no thermals): 44.45,53.34 44.45,13.34 52.07,13.34 56.52,17.78 56.52,42.55 65.41,51.44 65.41,57.78 48.36,57.78
  pour Top (no thermals): 48.89,57.78 48.89,52.7 51.44,50.16 59.05,50.16 59.05,52.7 59.69,53.34 64.77,53.34 64.77,57.78
ANA_BAT
  Top 0.406: JP5.1 U2.P$28
BAT_LVL  (via drill 0.35)
  Top 0.305: D5.3 76.95,18.96 R6.1 R7.2
  Top 0.406: R7.2 76.77,21.59 v83.82,21.59 | v88.9,27.94 73.66,27.94 71.75,29.84 U2.P$36
  Bottom 0.406: v88.9,27.94 88.9,26.67 v83.82,21.59
CADENCE
  Top 0.406: JP6.2 88.9,39.37 90.17,40.64 90.17,42.55 88.9,43.81 87.63,43.81 87,44.45 U2.P$10
CHP_ENABLE  (via drill 0.35)
  Top 0.305: M1.3 63.5,21.59 v68.58,21.59
  Bottom 0.305: U2.P$35 74.3,27.3 v68.58,21.59
CLK  (via drill 0.35)
  Top 0.305: M1.5 63.5,19.05 v68.58,19.05
  Bottom 0.305: U2.P$31 80.64,26.67 76.2,26.67 v68.58,19.05
CS  (via drill 0.35)
  Top 0.305: M1.4 v68.58,20.32
  Bottom 0.305: U2.P$32 81.91,29.84 80.01,27.94 76.2,27.94 v68.58,20.32
DHT_DATA  (via drill 0.35)
  Top 0.305: R5.1 43.18,5.85 U4.2
  Top 0.406: U4.2 43.18,7.62 45.08,9.53 53.97,9.53 58.42,13.97 66.04,13.97 66.67,14.61 76.2,14.61 77.47,15.88 80.64,15.88 v82.55,17.78 | v90.81,27.94 90.81,31.75 89.53,33.02 85.72,33.02 84.45,34.29 U2.P$11
  Bottom 0.406: v90.81,27.94 90.81,26.04 v82.55,17.78
ENCODER  (via drill 0.35)
  Top 0.305: v43.18,45.09 48.89,45.09 52.07,48.26 v71.12,48.26
  Bottom 0.305: J4.3 31.75,46.28 31.75,47.62 32.39,48.26 36.57,48.26 39.75,45.09 v43.18,45.09 | v71.12,48.26 81.28,48.26 81.91,47.62 U2.P$12
GND  (via drill 0.35)
  Top 0.305: D6.A 102.04,22.23 v104.14,22.23 | v104.14,20.32 102.88,20.32 102.23,19.67 U5.2 | D9.A 104.14,13.34
  Top 0.406: D8.1 115.46,12.7 v114.3,12.7 114.94,12.06 114.94,9.53 112.53,9.53 R8.2 | v114.94,20.32 R9.2
  Top 0.635: 12.7,42.67 11.43,42.67 8.45,45.65 R25.1 | 12.7,42.67 U7.2 | v14.99,42.67 12.7,42.67 | v17.27,51.56 19.03,51.56 C11.2 | 6.1,45.12 6.1,45.97 C12.2 | 12.7,26.16 11.43,26.16 8.45,29.14 R31.1 | 12.7,26.16 U9.2 | v14.99,26.16 12.7,26.16 | v17.27,35.05 19.03,35.05 C15.2 | 6.1,28.61 6.1,29.46 | 6.1,29.46 C16.2 | 6.1,29.46 6.42,29.14 6.98,29.14 | 15.75,12.7 15.75,11.43 12.77,8.45 R37.1 12.77,7.62 | 15.75,12.7 U11.2 | v15.75,14.99 15.75,12.7 | v6.86,17.27 6.86,19.03 C19.2 | 32.26,12.7 32.26,11.43 29.28,8.45 R43.1 29.28,6.42 28.96,6.1 | 32.26,12.7 U13.2 | v32.26,14.99 32.26,12.7 | v23.37,17.27 23.37,19.03 C23.2 | R42.2 29.81,6.1 28.96,6.1 | 28.96,6.1 C24.2
  Top 1.27: R30.2 6.1,28.61 C16.2 | 6.98,29.14 R31.1 | R24.2 6.1,45.12 C12.2 | 6.1,45.97 6.42,45.65 R25.1 | C24.2 29.81,6.1 | 29.81,6.1 30.6,5.3 | 30.6,5.3 30.65,5.3 | 30.6,5.3 30.56,5.3 30.49,5.24 | C20.2 13.3,6.1 | 13.3,6.1 R36.2 | R37.1 12.77,6.63 13.3,6.1 | R43.1 29.28,6.63 29.81,6.1
  Bottom 0.305: v104.14,22.23 v104.14,20.32
  Bottom 0.406: v114.3,12.7 114.3,19.68 v114.94,20.32
  Bottom 0.635: v17.27,51.56 17.27,52.75 JMP2.3 15.83,53.09 14.99,52.25 v14.99,42.67 | v17.27,35.05 17.27,36.24 JMP4.3 15.83,36.58 14.99,35.74 v14.99,26.16 | v6.86,17.27 5.67,17.27 JMP6.3 5.33,15.83 6.17,14.99 v15.75,14.99 | v23.37,17.27 22.18,17.27 JMP8.3 21.84,15.83 22.68,14.99 v32.26,14.99
  pour Top (rank 6, no thermals): 0.27,57.78 118.11,57.78 118.11,0 0.27,0
GPS_RX
  Top 0.406: R3.2 U2.P$34
GPS_TX
  Top 0.406: R4.2 U2.P$33
HEAD_BTN  (via drill 0.35)
  Top 0.406: U2.P$1 v109.86,43.18
  Bottom 0.406: v109.86,43.18 J3.2
HEAD_CTRL  (via drill 0.35)
  Top 0.254: U7.4 14.58,47.24 21.19,47.24 25.13,51.18 25.15,51.18 v26.03,52.07 | v69.85,49.53 69.22,48.9 51.56,48.9 48.41,45.74 44.37,45.74 43.81,46.3 v43.81,48.9
  Top 0.305: U2.P$14 R21.1
  Bottom 0.254: v26.03,52.07 40.64,52.07 v43.81,48.9 | U2.P$14 76.84,46.61 75.95,47.5 70.48,47.5 69.85,48.13 v69.85,49.53
LEFT_BTN  (via drill 0.35)
  Top 0.406: v107.31,38.1 104.78,40.64 U2.P$3
  Bottom 0.406: v107.31,38.1 J3.4
LEFT_CTRL  (via drill 0.35)
  Top 0.254: U11.4 12.11,15.2 v10.8,16.51 | v13.97,16.51 v15.88,16.51 | v18.42,19.68 19.43,20.7 19.43,23.73 26.19,30.49 26.42,30.49 v26.67,30.74 | v57.81,29.97 v44.45,29.97 | v57.81,39.37 59.71,41.27 69.85,41.27 71.49,42.92 R23.1
  Top 0.305: U2.P$16 R23.1
  Bottom 0.254: v10.8,16.51 v13.97,16.51 | v15.88,16.51 18.42,19.05 v18.42,19.68 | v26.67,30.74 33.01,30.74 33.33,30.42 33.71,30.42 34.29,29.84 44.32,29.84 v44.45,29.97 | v57.81,29.97 v57.81,39.37
MISO
  Bottom 0.305: M1.7 63.5,16.51 67.31,16.51 76.2,25.4 82.55,25.4 87,29.84 U2.P$30
MOSI  (via drill 0.35)
  Top 0.305: M1.6 v69.85,17.78
  Bottom 0.305: v69.85,17.78 76.2,24.13 83.19,24.13 U2.P$29
N$1
  Top 0.305: R1.2 94.61,42.68 U2.P$7
N$2
  Top 0.305: R2.2 96.66,45.22 U2.P$6
N$3
  Top 0.305: U1.8 69.89,53.85 69.89,51.4 73.03,48.26 92.71,48.26 93.34,47.62 93.34,43.76 92.84,43.26 R1.1 92.84,39.7 D1.3
N$4
  Top 0.305: U1.10 72.43,53.85 72.43,50.76 73.66,49.53 96.52,49.53 98.42,47.62 98.42,42.68 R2.1 98.42,41.14 D2.3
N$5  (via drill 0.35)
  Top 0.406: D3.3 71.42,33.52 | 71.42,33.52 R3.1 | v43.18,34.29 43.95,33.52 71.42,33.52
  Bottom 0.406: M2.RX 40.81,36.66 v43.18,34.29
N$6
  Top 0.406: U1.7 68.69,50.28 67.94,49.53 48.06,49.53 S1.2 S1.1
N$7
  Top 0.305: D8.3 113.58,16.44 G3.3 115.28,16.61 R10.1
N$8
  Top 0.406: G1.3 109.15,9.63 D7.A 111.72,10.66 R8.1
N$9  (via drill 0.35)
  Top 0.406: 77.87,34.69 D4.3 | R4.1 79.38,34.46 79.14,34.69 77.87,34.69 | 77.87,34.69 72.79,34.69 v72.39,34.29 | v68.58,34.29 v44.45,34.29
  Bottom 0.406: v72.39,34.29 v68.58,34.29 | v44.45,34.29 43.36,35.38 M2.TX
N$10  (via drill 0.35)
  Top 0.305: v71.88,2.41 70.83,2.41 LED2.A | v112.39,15.24 112.14,14.99 G2.3
  Bottom 0.305: v112.39,15.24 112.39,14.81 110.39,12.81 110.39,3.17 108.49,1.27 73.03,1.27 v71.88,2.41
  pour Top (no thermals): 112.39,19.05 112.39,15.24 112.14,14.99 110.87,14.99 110.87,20.57 111.89,20.57 112.01,20.45 112.01,19.43
N$11
  Top 0.305: LED3.C R17.2
N$12
  Top 0.406: C1.1 37.24,20.93 U3.4
N$13
  Top 0.305: U5.3 101.28,19.37 103.23,21.32 D6.C 103.35,21.34 R11.1
N$14
  Top 0.406: L1.1 45.18,24.11 C4.2
  pour Top (no thermals): 41.91,24.13 43.56,24.13 43.94,23.75 46.1,23.75 46.99,22.86 46.99,19.05 45.72,17.78 44.45,17.78 43.81,18.41 43.81,22.23 43.18,22.86 41.66,22.86 41.53,22.99 41.53,23.75
N$15
  Top 0.406: C2.1 35.56,19.68 35.56,22.86 36.19,23.5 U3.3
N$16
  Top 0.406: U3.7 44.34,24.77 C4.1
N$17  (via drill 0.35)
  Top 0.305: v69.22,8.89 68.58,9.53 68.58,10.16 68.08,10.66 R17.1 | R14.2 101.73,12.56 v102.23,12.06
  Top 0.406: U5.4 101.28,14.69 R14.2
  Bottom 0.305: v69.22,8.89 84.48,8.89 89.53,13.95 89.53,17.14 96.14,23.75 101.35,23.75 102.23,22.86 v102.23,12.06
N$18  (via drill 0.35)
  Top 0.305: R14.1 105.78,14.24 v106.05,13.97 | U3.1 37.24,27.53 36.19,28.57 33.02,28.57 v29.84,25.4
  Top 0.406: R14.1 104.07,15.58 D9.C
  Bottom 0.305: v106.05,13.97 100.33,8.26 100.33,4.45 98.81,2.92 80.9,2.92 80.01,3.81 71.12,3.81 68.58,1.27 39.37,1.27 34.92,5.71 34.92,20.32 v29.84,25.4
N$19  (via drill 0.35)
  Top 0.305: U5.1 103.19,18.98 v104.14,18.03
  Bottom 0.305: R28.S 112.39,21.59 108.84,18.03 v104.14,18.03
N$20
  Top 0.305: LED1.C R16.2
N$21
  Top 0.305: R16.1 73.8,10.79 75.56,10.79 78.1,8.26 D10.A
N$22
  Top 0.406: M2.EN 50.97,42.22 53.2,44.45 R20.2
N$23
  Top 0.305: R18.1 LED2.C
N$24
  Top 0.305: R19.2 LED4.C
N$25  (via drill 0.35)
  Top 0.305: G3.4 114.33,18.03 R10.2 116.2,18.53 v116.2,19.05 | G2.1 112.55,11.43 v113.66,11.43
  Bottom 0.305: v113.66,11.43 114.94,11.43 116.2,12.7 v116.2,19.05
  pour Top (no thermals): 108.58,13.97 111.12,13.97 111.12,12.7 109.86,11.43 106.93,11.43 106.93,12.32
N$31
  Top 0.635: L3.2 10.35,45.51 U7.1
  Top 1.27: L3.2 9.39,52.07 D12.A
N$32
  Bottom 0.305: JMP2.2 19.3,48.64 R26.E
N$33
  Top 0.305: U7.3 14.73,44.11 16.59,45.97 R26.S
N$34  (via drill 0.35)
  Top 0.305: C12.1 7.87,50.27 8.13,50.01 v8.13,49.28 | v13.97,48.01 12.7,46.74 U7.5
  Top 0.635: JP1.1 3.28,50.27 3.81,50.27 | 3.81,50.27 C12.1 | D12.C 3.56,50.52 3.81,50.27
  Top 1.27: D12.C 3.56,50.55 | JP1.1 3.56,50.55 | 3.56,50.55 5.81,50.55 C12.1
  Bottom 0.305: v13.97,48.01 8.89,48.01 8.13,48.77 v8.13,49.28
N$35  (via drill 0.35)
  Top 0.305: R25.2 9.08,43.75 v10.92,41.91
  Top 1.27: JP1.2 3.47,46.57 R24.1 3.47,42.93 4.04,42.35 6.76,42.35 8.13,43.72 R25.2
  Bottom 0.305: v10.92,41.91 15.75,41.91 15.75,43.18 16,43.43 R26.A
N$41
  Top 0.635: D14.A 8.25,37.34 | L5.2 10.35,29 U9.1
  Top 1.27: 8.25,37.34 10.03,35.56 L5.2
N$42
  Bottom 0.305: JMP4.2 19.3,32.13 R32.E
N$43
  Top 0.305: U9.3 14.73,27.6 16.59,29.46 R32.S
N$44  (via drill 0.35)
  Top 0.305: C16.1 7.87,33.76 8.13,33.5 v8.13,32.77 | v13.97,31.5 12.7,30.23 U9.5
  Top 0.635: 3.28,33.76 3.81,33.76 | 3.81,33.76 C16.1 | D14.C 3.56,34.01 3.81,33.76
  Top 1.27: D14.C 3.56,34.04 JP2.1 3.28,33.76 C16.1
  Bottom 0.305: v13.97,31.5 8.89,31.5 8.13,32.26 v8.13,32.77
N$45  (via drill 0.35)
  Top 0.305: R31.2 9.08,27.24 v10.92,25.4
  Top 1.27: JP2.2 3.47,30.06 R30.1 3.47,26.09 7.01,26.09 8.13,27.21 R31.2
  Bottom 0.305: v10.92,25.4 15.75,25.4 15.75,26.67 16,26.92 R32.A
N$51
  Top 0.635: D16.A 4.57,8.57 L7.2 6.98,10.35 12.91,10.35 U11.1
  Top 1.27: D16.A 4.57,7.94 6.98,10.35
N$52
  Bottom 0.305: JMP6.2 9.78,19.3 R38.E
N$53
  Top 0.305: U11.3 14.31,14.73 12.45,16.59 R38.S
N$54  (via drill 0.35)
  Top 0.305: C20.1 8.15,7.87 8.41,8.13 v9.14,8.13 | v10.41,13.97 11.68,12.7 U11.5
  Top 0.635: 8.15,3.28 8.15,3.81 | 8.15,3.81 C20.1 | D16.C 7.91,3.56 8.15,3.81
  Top 1.27: D16.C 7.87,3.56 JP3.1 8.15,3.28 C20.1
  Bottom 0.305: v10.41,13.97 10.41,8.89 9.65,8.13 v9.14,8.13
N$55  (via drill 0.35)
  Top 0.305: R37.2 14.67,9.08 v16.51,10.92
  Top 0.635: 11.85,3.47 R36.1 14.48,3.47
  Top 1.27: JP3.2 11.85,3.47 14.48,3.47 | R36.1 15.94,3.47 15.94,6.86 R37.2
  Bottom 0.305: v16.51,10.92 16.51,15.75 15.24,15.75 14.99,16 R38.A
N$61
  Top 0.635: L9.2 29.42,10.35 U13.1
  Top 1.27: D18.A 21.08,8.57 L9.2
N$62
  Bottom 0.305: JMP8.2 26.29,19.3 R44.E
N$63
  Top 0.305: U13.3 30.82,14.73 28.96,16.59 R44.S
N$64  (via drill 0.35)
  Top 0.305: C24.1 24.66,6.35 24.66,7.87 24.92,8.13 v25.65,8.13 | v26.92,13.97 28.19,12.7 U13.5
  Top 0.635: 24.66,3.28 24.66,3.81 | 24.66,3.81 C24.1 | 24.42,3.56 24.66,3.81
  Top 1.27: JP4.1 24.66,3.28 24.66,6.35 | D18.C 24.42,3.56
  Bottom 0.305: v26.92,13.97 26.92,8.89 26.16,8.13 v25.65,8.13
N$65  (via drill 0.35)
  Top 0.305: R43.2 31.18,9.08 v33.02,10.92
  Top 1.27: JP4.2 28.36,3.47 R42.1 33.34,3.47 33.34,5.99 31.21,8.13 R43.2
  Bottom 0.305: v33.02,10.92 33.02,15.75 31.75,15.75 31.5,16 R44.A
RF_INT  (via drill 0.35)
  Top 0.305: v59.69,17.78 59.69,17.14 60.33,16.51 63.5,16.51 M1.8 | v59.69,43.18 v67.31,43.18
  Bottom 0.305: v59.69,17.78 v59.69,43.18 | v67.31,43.18 78.74,43.18 79.38,43.81 U2.P$13
RIGHT_BTN  (via drill 0.35)
  Top 0.406: v107.31,35.56 102.23,40.64 U2.P$4
  Bottom 0.406: v107.31,35.56 J3.5
RIGHT_CTRL  (via drill 0.35)
  Top 0.254: U13.4 28.62,15.2 v27.94,15.88 | v27.94,25.4 31.8,29.26 v33.66,29.26 | v57.15,40.01 59.05,41.91 67.44,41.91 68.44,42.92 R27.1 | v45.08,29.21 v57.15,29.21
  Top 0.305: R27.1 U2.P$17
  Bottom 0.254: v27.94,15.88 v27.94,25.4 | v33.66,29.26 45.04,29.26 v45.08,29.21 | v57.15,29.21 v57.15,40.01
TAIL_BTN  (via drill 0.35)
  Top 0.406: v108.58,40.64 107.31,41.91 U2.P$2
  Bottom 0.406: v108.58,40.64 J3.3
TAIL_CTRL  (via drill 0.35)
  Top 0.254: U9.4 14.58,30.73 25.5,30.73 v25.52,30.75 | v58.59,30.86 58.46,30.73 v45.21,30.73 | v58.46,38.73 60.37,40.64 71.75,40.64 74.03,42.92 R22.1
  Top 0.305: R22.1 U2.P$15
  Bottom 0.254: v25.52,30.75 25.75,30.75 26.4,31.4 30.76,31.4 32.44,33.08 42.87,33.08 v45.21,30.73 | v58.46,38.73 58.59,38.61 v58.59,30.86
V+  (via drill 0.35, 1)
  Top 0.305: U13.6 24.57,11.75 23.62,12.7 23.62,14.29 L9.1 | U11.6 8.06,11.75 7.11,12.7 7.11,14.29 L7.1 6.06,15.05 | U9.6 11.75,33.85 12.7,34.8 14.29,34.8 L5.1 | U7.6 11.75,50.36 12.7,51.31 14.29,51.31 L3.1 | U5.5 107.09,16.58 G2.4 | R6.2 80.85,20.67 J5.1 | LED3.A 66.58,2.63 v65.66,3.56
  Top 0.406: TP2.TP 23.24,32.89 v21.08,35.05
  Top 0.635: 22.57,15.05 L9.1 | v20.34,21.08 v23.37,21.08 | v3.83,21.08 v6.86,21.08 | 18.42,38.08 C15.1 19.81,38.08 21.08,36.81 v21.08,35.05 | C11.1 19.81,54.59 21.08,53.32 v21.08,51.56
  Top 1.27: 22.57,15.05 20.34,17.27 C23.1 v20.34,21.08 21.59,22.33 v21.59,22.86 | 6.06,15.05 3.83,17.27 C19.1 v3.83,21.08 2.41,21.08 v1.91,21.59 | L5.1 17.57,38.08 18.42,38.08 | L3.1 17.57,54.59 C11.1 20.34,55.88 v20.95,55.88 v22.22,55.88 | C15.1 20.34,39.37 v20.95,39.37 v22.22,39.37 | C8.1 42.84,28.07
  Top 2.54: R28.E v105.41,26.04 | v95.25,26.04 69.85,26.04 69.22,26.67 44.24,26.67 42.84,28.07
  Bottom 0.305: 23.5,26.67 23.5,24.77 v21.59,22.86 | v65.66,3.56 65.66,11.42 65.66,11.43
  Bottom 3.81: 23.5,26.67 24.77,27.94 31.11,27.94 38.1,20.95 38.1,15.24 41.91,11.43 65.66,11.43 83.89,11.43 J5.1 87,17.78 v95.25,26.04 v97.79,26.04 v100.33,26.04 v102.87,26.04 v105.41,26.04 108.58,26.04
  pour Top (no thermals): 111.12,27.94 111.12,22.86 109.22,20.95 109.22,14.86 106.17,14.86 106.17,23.5 104.78,24.89 92.84,24.89 95.88,27.94
  pour Bottom (no thermals): 0.64,20.32 0.64,21.59 3.17,24.13 18.42,24.13 19.69,25.4 19.69,55.88 20.95,57.15 23.5,57.15 24.77,55.88 24.77,21.59 23.5,20.32
  pour Top (no thermals): 41.4,25.4 43.81,25.4 43.81,30.48 43.18,31.11 41.4,31.11
  pour Bottom (no thermals): 107.31,27.05 107.31,23.75 111.12,23.75 111.12,27.94 108.2,27.94
VCC  (via drill 0.35)
  Top 0.305: D10.C 78.31,2.54 v80.01,2.54
  Top 0.406: 107.31,2.54 J1.2
  Bottom 0.305: v80.01,2.54 80.01,2.29 80.52,1.78 104.65,1.78 J1.2
  pour Top (no thermals): 104.78,12.19 106.3,12.19 106.3,8.64 106.68,8.26 107.95,8.26 108.58,7.62 108.58,2.54 107.95,1.91 106.68,1.91 104.78,3.81

### Text on the board
tValues: GND | ENC | 5V | 3V3 | RPI ON SERIAL1 | GND | HEAD | 3V3 | TAIL | GPS ON SERIAL2 | LEFT | 5V | RIGHT | V+ | GND | GND | PA4-CS / PA1-EN / PB5-INT
bValues: HEAD+ | RPI ON SERIAL1 | GND | ENC | 5V | 3V3 | GND | HEAD | 3V3 | TAIL | GPS ON SERIAL2 | CAD | LEFT | 5V | GND | ANA.BAT. | GND | RIGHT | TAIL+ | GND | Above here lies / the 5V regulator | PA4-CS / PA1-EN / PB5-INT | Above here are / protection circuits / for reverse polarity, / over/under-voltage | University of Toronto Human Powered Vehicle Design Team / Blueshift Digital Electronics Board V.3 / hpv@hpvdt.skule.ca | GND | +BAT | LEFT+ | RIGHT+